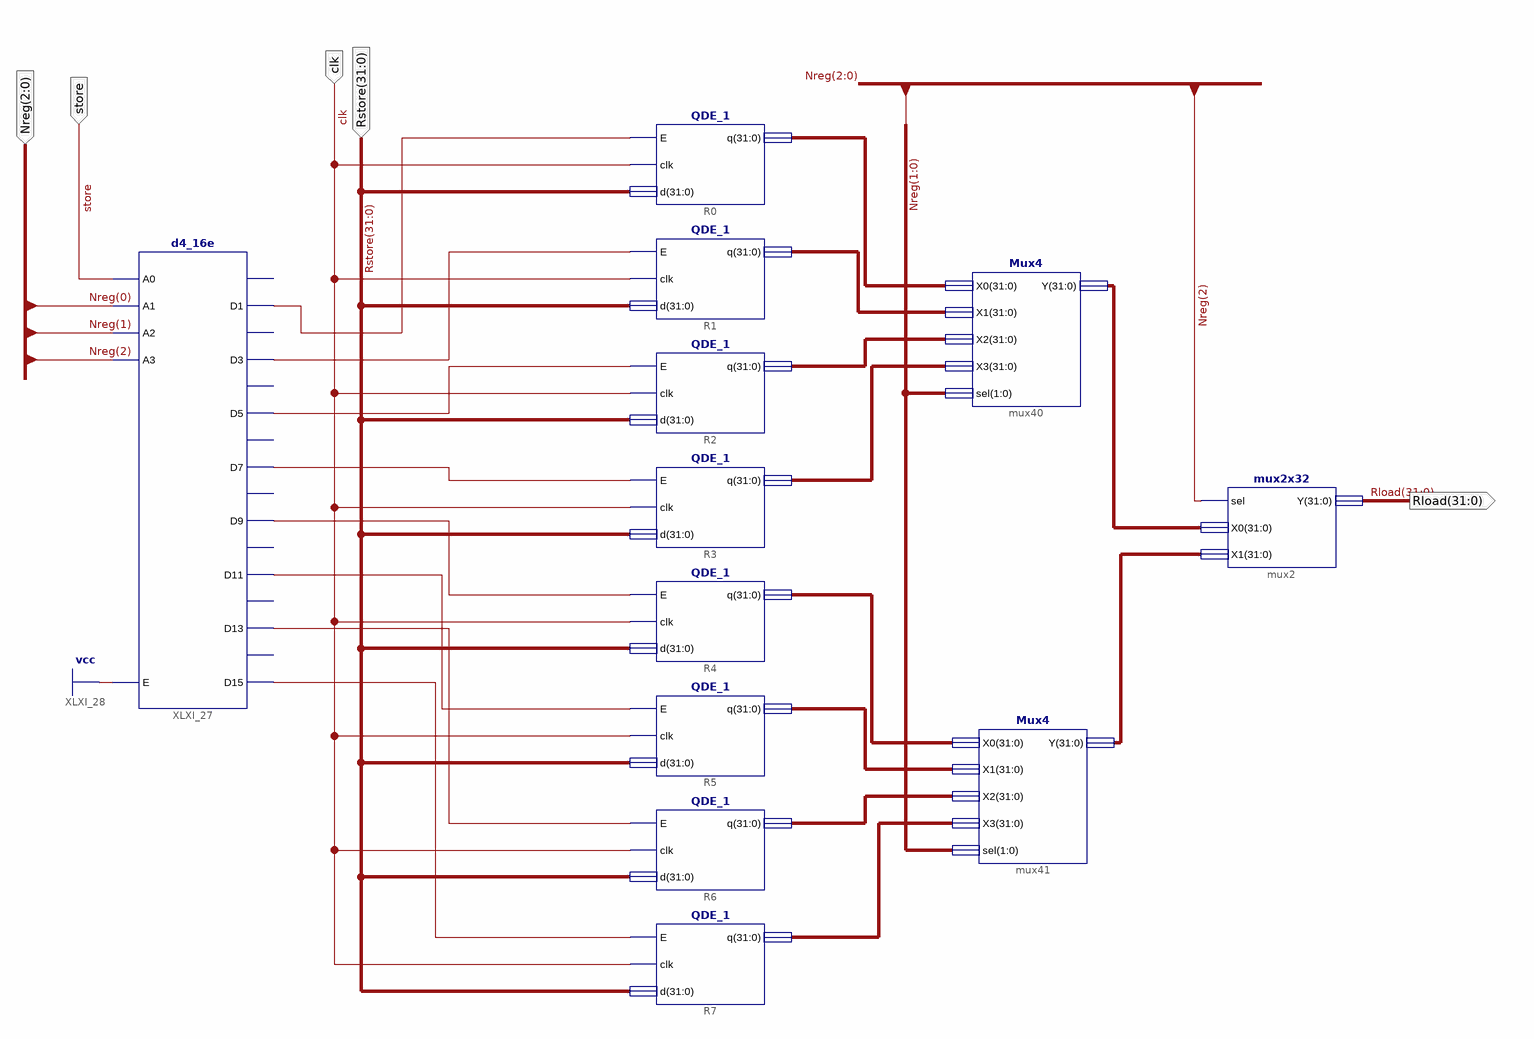
[diagram p0: schematic sheet 1]
// Xilinx ISE schematic regfile.sch (virtex7) as structural Verilog: 12 symbols, 5 ports
module regfile (
  input  [31:0] Rstore,
  input  clk,
  input  [2:0] Nreg,
  input  store,
  output [31:0] Rload
);

  wire XLXN_49, XLXN_50, XLXN_51, XLXN_52, XLXN_53, XLXN_54, XLXN_55, XLXN_56;
  wire [31:0] XLXN_7, XLXN_8, XLXN_9, XLXN_10, XLXN_11, XLXN_12, XLXN_13, XLXN_14, XLXN_15, XLXN_16;

  Mux4 mux40 (.X0(XLXN_7), .X1(XLXN_8), .X2(XLXN_9), .X3(XLXN_10), .sel(Nreg[1:0]), .Y(XLXN_15));
  Mux4 mux41 (.X0(XLXN_11), .X1(XLXN_12), .X2(XLXN_13), .X3(XLXN_14), .sel(Nreg[1:0]), .Y(XLXN_16));
  d4_16e XLXI_27 (
    .A0(store), .A1(Nreg[0]), .A2(Nreg[1]), .A3(Nreg[2]), .E(1'b1), .D1(XLXN_49), .D11(XLXN_54),
    .D13(XLXN_55), .D15(XLXN_56), .D3(XLXN_50), .D5(XLXN_51), .D7(XLXN_52), .D9(XLXN_53));  // open: D0, D10, D12, D14, D2, D4, D6, D8
  QDE_1 R0 (.E(XLXN_49), .clk(clk), .d(Rstore), .q(XLXN_7));
  QDE_1 R1 (.E(XLXN_50), .clk(clk), .d(Rstore), .q(XLXN_8));
  QDE_1 R2 (.E(XLXN_51), .clk(clk), .d(Rstore), .q(XLXN_9));
  QDE_1 R3 (.E(XLXN_52), .clk(clk), .d(Rstore), .q(XLXN_10));
  QDE_1 R4 (.E(XLXN_53), .clk(clk), .d(Rstore), .q(XLXN_11));
  QDE_1 R5 (.E(XLXN_54), .clk(clk), .d(Rstore), .q(XLXN_12));
  QDE_1 R6 (.E(XLXN_55), .clk(clk), .d(Rstore), .q(XLXN_13));
  QDE_1 R7 (.E(XLXN_56), .clk(clk), .d(Rstore), .q(XLXN_14));
  mux2x32 mux2 (.sel(Nreg[2]), .X0(XLXN_15), .X1(XLXN_16), .Y(Rload));
endmodule
